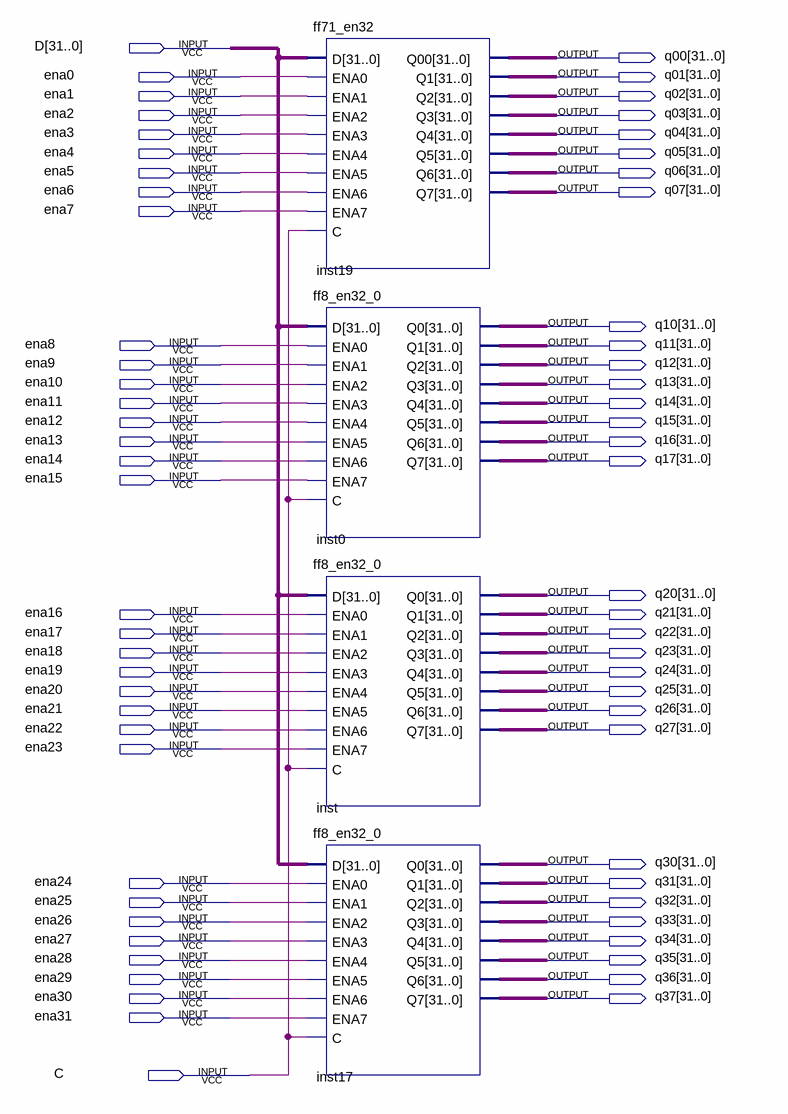
[diagram p0: schematic sheet]
// Quartus schematic reg32_en32.bdf as structural Verilog: 4 symbols, 66 pins
module reg32_en32 (
  input  [31:0] D,
  input  ena0,
  input  ena1,
  input  ena2,
  input  ena3,
  input  ena4,
  input  ena5,
  input  ena6,
  input  ena7,
  input  ena8,
  input  ena9,
  input  ena10,
  input  ena11,
  input  ena12,
  input  ena13,
  input  ena14,
  input  ena15,
  input  ena16,
  input  ena17,
  input  ena18,
  input  ena19,
  input  ena20,
  input  ena21,
  input  ena22,
  input  ena23,
  input  ena24,
  input  ena25,
  input  ena26,
  input  ena27,
  input  ena28,
  input  ena29,
  input  ena30,
  input  ena31,
  input  C,
  output [31:0] q00,
  output [31:0] q01,
  output [31:0] q02,
  output [31:0] q03,
  output [31:0] q04,
  output [31:0] q05,
  output [31:0] q06,
  output [31:0] q07,
  output [31:0] q10,
  output [31:0] q11,
  output [31:0] q12,
  output [31:0] q13,
  output [31:0] q14,
  output [31:0] q15,
  output [31:0] q16,
  output [31:0] q17,
  output [31:0] q20,
  output [31:0] q21,
  output [31:0] q22,
  output [31:0] q23,
  output [31:0] q24,
  output [31:0] q25,
  output [31:0] q26,
  output [31:0] q27,
  output [31:0] q30,
  output [31:0] q31,
  output [31:0] q32,
  output [31:0] q33,
  output [31:0] q34,
  output [31:0] q35,
  output [31:0] q36,
  output [31:0] q37
);

  ff71_en32 inst19 (
    .D(D), .ENA0(ena0), .ENA1(ena1), .ENA2(ena2), .ENA3(ena3), .ENA4(ena4), .ENA5(ena5), .ENA6(ena6),
    .ENA7(ena7), .C(C), .Q00(q00), .Q1(q01), .Q2(q02), .Q3(q03), .Q4(q04), .Q5(q05), .Q6(q06), .Q7(q07));
  ff8_en32_0 inst0 (
    .D(D), .ENA0(ena8), .ENA1(ena9), .ENA2(ena10), .ENA3(ena11), .ENA4(ena12), .ENA5(ena13), .ENA6(ena14),
    .ENA7(ena15), .C(C), .Q0(q10), .Q1(q11), .Q2(q12), .Q3(q13), .Q4(q14), .Q5(q15), .Q6(q16), .Q7(q17));
  ff8_en32_0 inst (
    .D(D), .ENA0(ena16), .ENA1(ena17), .ENA2(ena18), .ENA3(ena19), .ENA4(ena20), .ENA5(ena21), .ENA6(ena22),
    .ENA7(ena23), .C(C), .Q0(q20), .Q1(q21), .Q2(q22), .Q3(q23), .Q4(q24), .Q5(q25), .Q6(q26), .Q7(q27));
  ff8_en32_0 inst17 (
    .D(D), .ENA0(ena24), .ENA1(ena25), .ENA2(ena26), .ENA3(ena27), .ENA4(ena28), .ENA5(ena29), .ENA6(ena30),
    .ENA7(ena31), .C(C), .Q0(q30), .Q1(q31), .Q2(q32), .Q3(q33), .Q4(q34), .Q5(q35), .Q6(q36), .Q7(q37));
endmodule
